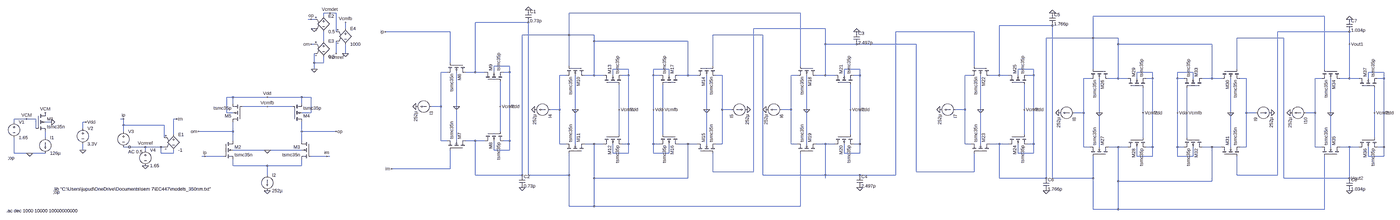
[diagram p0: schematic gm_macro_filter.asc, whole sheet]
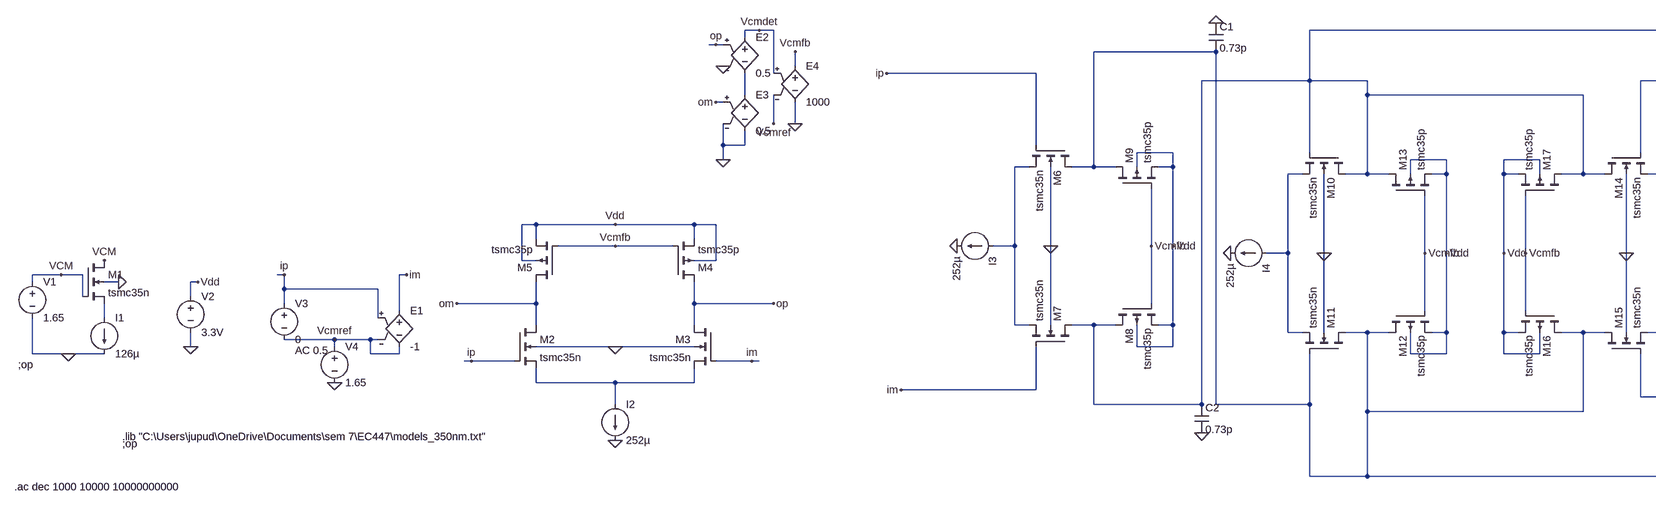
[diagram p1: schematic gm_macro_filter.asc, part, row 1 of 1, column 1 of 2]
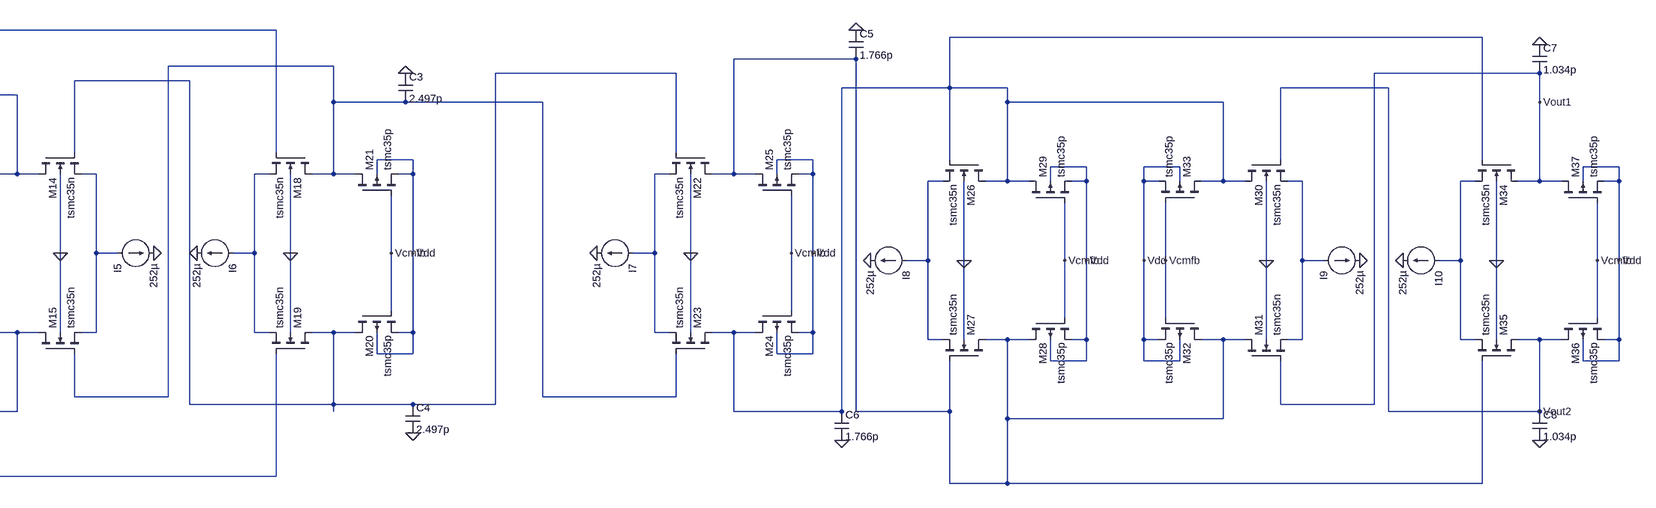
[diagram p2: schematic gm_macro_filter.asc, part, row 1 of 1, column 2 of 2]
gm_macro_filter.asc, the LTspice schematic file:
Version 4
SHEET 1 6368 680
WIRE 576 -576 544 -576
WIRE 608 -576 576 -576
WIRE 3184 -576 2000 -576
WIRE 544 -560 544 -576
WIRE 5984 -560 4800 -560
WIRE 480 -544 464 -544
WIRE 496 -544 480 -544
WIRE 1792 -528 1520 -528
WIRE 4592 -512 4320 -512
WIRE 656 -496 656 -528
WIRE 3312 -496 2944 -496
WIRE 608 -480 608 -576
WIRE 1392 -480 1008 -480
WIRE 4192 -480 3728 -480
WIRE 6112 -480 5744 -480
WIRE 2000 -464 2000 -576
WIRE 2000 -464 1760 -464
WIRE 2128 -464 2000 -464
WIRE 2992 -464 2736 -464
WIRE 4800 -448 4800 -560
WIRE 4800 -448 4560 -448
WIRE 4928 -448 4800 -448
WIRE 5776 -448 5536 -448
WIRE 544 -432 544 -480
WIRE 2128 -432 2128 -464
WIRE 2608 -432 2128 -432
WIRE 496 -416 480 -416
WIRE 3312 -416 3312 -496
WIRE 3472 -416 3312 -416
WIRE 3840 -416 3472 -416
WIRE 4928 -416 4928 -448
WIRE 5408 -416 4928 -416
WIRE 6112 -416 6112 -480
WIRE 608 -368 608 -432
WIRE 656 -368 656 -416
WIRE 496 -320 496 -368
WIRE 544 -320 544 -352
WIRE 544 -320 496 -320
WIRE 1392 -320 1392 -480
WIRE 1696 -304 1616 -304
WIRE 2000 -304 2000 -464
WIRE 2736 -304 2736 -464
WIRE 3184 -304 3184 -576
WIRE 4192 -304 4192 -480
WIRE 496 -288 496 -320
WIRE 2304 -288 2224 -288
WIRE 2512 -288 2432 -288
WIRE 3488 -288 3408 -288
WIRE 4496 -288 4416 -288
WIRE 4800 -288 4800 -448
WIRE 5536 -288 5536 -448
WIRE 5984 -288 5984 -560
WIRE 1376 -272 1344 -272
WIRE 1520 -272 1520 -528
WIRE 1520 -272 1472 -272
WIRE 1568 -272 1520 -272
WIRE 1616 -272 1616 -304
WIRE 1696 -272 1696 -304
WIRE 1696 -272 1664 -272
WIRE 5104 -272 5024 -272
WIRE 5312 -272 5232 -272
WIRE 6288 -272 6208 -272
WIRE 1984 -256 1952 -256
WIRE 2128 -256 2128 -432
WIRE 2128 -256 2080 -256
WIRE 2176 -256 2128 -256
WIRE 2224 -256 2224 -288
WIRE 2304 -256 2304 -288
WIRE 2304 -256 2272 -256
WIRE 2432 -256 2432 -288
WIRE 2464 -256 2432 -256
WIRE 2512 -256 2512 -288
WIRE 2608 -256 2608 -432
WIRE 2608 -256 2560 -256
WIRE 2656 -256 2608 -256
WIRE 2784 -256 2752 -256
WIRE 3168 -256 3136 -256
WIRE 3312 -256 3312 -416
WIRE 3312 -256 3264 -256
WIRE 3360 -256 3312 -256
WIRE 3408 -256 3408 -288
WIRE 3488 -256 3488 -288
WIRE 3488 -256 3456 -256
WIRE 4176 -256 4144 -256
WIRE 4320 -256 4320 -512
WIRE 4320 -256 4272 -256
WIRE 4368 -256 4320 -256
WIRE 4416 -256 4416 -288
WIRE 4496 -256 4496 -288
WIRE 4496 -256 4464 -256
WIRE 4784 -240 4752 -240
WIRE 4928 -240 4928 -416
WIRE 4928 -240 4880 -240
WIRE 4976 -240 4928 -240
WIRE 5024 -240 5024 -272
WIRE 5104 -240 5104 -272
WIRE 5104 -240 5072 -240
WIRE 5232 -240 5232 -272
WIRE 5264 -240 5232 -240
WIRE 5312 -240 5312 -272
WIRE 5408 -240 5408 -416
WIRE 5408 -240 5360 -240
WIRE 5456 -240 5408 -240
WIRE 5584 -240 5552 -240
WIRE 5968 -240 5936 -240
WIRE 6112 -240 6112 -416
WIRE 6112 -240 6064 -240
WIRE 6160 -240 6112 -240
WIRE 6208 -240 6208 -272
WIRE 6288 -240 6288 -272
WIRE 6288 -240 6256 -240
WIRE 80 -144 48 -144
WIRE 256 -144 80 -144
WIRE 432 -144 256 -144
WIRE 480 -144 432 -144
WIRE 80 -112 80 -144
WIRE 432 -112 432 -144
WIRE 256 -96 128 -96
WIRE 384 -96 256 -96
WIRE 1344 -96 1344 -272
WIRE 1344 -96 1296 -96
WIRE 1424 -96 1424 -272
WIRE 1648 -96 1648 -224
WIRE 1696 -96 1696 -272
WIRE 1952 -80 1952 -256
WIRE 1952 -80 1904 -80
WIRE 2032 -80 2032 -256
WIRE 2256 -80 2256 -208
WIRE 2304 -80 2304 -256
WIRE 2432 -80 2432 -256
WIRE 2480 -80 2480 -208
WIRE 2704 -80 2704 -256
WIRE 2784 -80 2784 -256
WIRE 2832 -80 2784 -80
WIRE 3136 -80 3136 -256
WIRE 3136 -80 3088 -80
WIRE 3216 -80 3216 -256
WIRE 3440 -80 3440 -208
WIRE 3488 -80 3488 -256
WIRE 4144 -80 4144 -256
WIRE 4144 -80 4096 -80
WIRE 4224 -80 4224 -256
WIRE 4448 -80 4448 -208
WIRE 4496 -80 4496 -256
WIRE 48 -64 48 -144
WIRE 80 -64 48 -64
WIRE 480 -64 480 -144
WIRE 480 -64 432 -64
WIRE 4752 -64 4752 -240
WIRE 4752 -64 4704 -64
WIRE 4832 -64 4832 -240
WIRE 5056 -64 5056 -192
WIRE 5104 -64 5104 -240
WIRE 5232 -64 5232 -240
WIRE 5280 -64 5280 -192
WIRE 5504 -64 5504 -240
WIRE 5584 -64 5584 -240
WIRE 5632 -64 5584 -64
WIRE 5936 -64 5936 -240
WIRE 5936 -64 5888 -64
WIRE 6016 -64 6016 -240
WIRE 6240 -64 6240 -192
WIRE 6288 -64 6288 -240
WIRE -976 -32 -1040 -32
WIRE -928 -32 -976 -32
WIRE -480 -32 -496 -32
WIRE -208 -32 -224 -32
WIRE -1040 -16 -1040 -32
WIRE -848 -16 -880 -16
WIRE -672 -16 -688 -16
WIRE -480 0 -480 -32
WIRE -272 0 -480 0
WIRE -928 16 -928 -32
WIRE -688 16 -688 -16
WIRE -480 32 -480 0
WIRE 80 32 80 -16
WIRE 80 32 -96 32
WIRE 432 32 432 -16
WIRE 608 32 432 32
WIRE 1648 32 1648 -96
WIRE -224 48 -224 -32
WIRE 2256 48 2256 -80
WIRE 2480 48 2480 -80
WIRE 3440 48 3440 -80
WIRE 4448 48 4448 -80
WIRE -880 64 -880 32
WIRE -272 64 -272 0
WIRE 5056 64 5056 -64
WIRE 5280 64 5280 -64
WIRE 6240 64 6240 -64
WIRE 80 80 80 32
WIRE 432 80 432 32
WIRE 1344 80 1344 -96
WIRE 1376 80 1344 80
WIRE 1424 80 1424 -96
WIRE 1520 80 1472 80
WIRE 1568 80 1520 80
WIRE 1696 80 1696 -96
WIRE 1696 80 1664 80
WIRE 1952 96 1952 -80
WIRE 1984 96 1952 96
WIRE 2032 96 2032 -80
WIRE 2128 96 2080 96
WIRE 2176 96 2128 96
WIRE 2304 96 2304 -80
WIRE 2304 96 2272 96
WIRE 2432 96 2432 -80
WIRE 2464 96 2432 96
WIRE 2608 96 2560 96
WIRE 2656 96 2608 96
WIRE 2704 96 2704 -80
WIRE 2784 96 2784 -80
WIRE 2784 96 2752 96
WIRE 3136 96 3136 -80
WIRE 3168 96 3136 96
WIRE 3216 96 3216 -80
WIRE 3312 96 3264 96
WIRE 3360 96 3312 96
WIRE 3488 96 3488 -80
WIRE 3488 96 3456 96
WIRE 4144 96 4144 -80
WIRE 4176 96 4144 96
WIRE 4224 96 4224 -80
WIRE 4320 96 4272 96
WIRE 4368 96 4320 96
WIRE 4496 96 4496 -80
WIRE 4496 96 4464 96
WIRE -368 112 -480 112
WIRE -288 112 -368 112
WIRE -272 112 -288 112
WIRE 4752 112 4752 -64
WIRE 4784 112 4752 112
WIRE 4832 112 4832 -64
WIRE 4928 112 4880 112
WIRE 4976 112 4928 112
WIRE 5104 112 5104 -64
WIRE 5104 112 5072 112
WIRE 5232 112 5232 -64
WIRE 5264 112 5232 112
WIRE 5408 112 5360 112
WIRE 5456 112 5408 112
WIRE 5504 112 5504 -64
WIRE 5584 112 5584 -64
WIRE 5584 112 5552 112
WIRE 5936 112 5936 -64
WIRE 5968 112 5936 112
WIRE 6016 112 6016 -64
WIRE 6112 112 6064 112
WIRE 6160 112 6112 112
WIRE 6288 112 6288 -64
WIRE 6288 112 6256 112
WIRE -688 128 -688 96
WIRE -368 128 -368 112
WIRE 256 128 80 128
WIRE 432 128 256 128
WIRE 1616 128 1616 80
WIRE 1696 128 1696 80
WIRE 1696 128 1616 128
WIRE -1040 144 -1040 64
WIRE -960 144 -1040 144
WIRE -880 144 -960 144
WIRE -288 144 -288 112
WIRE -224 144 -224 128
WIRE -224 144 -288 144
WIRE 2224 144 2224 96
WIRE 2304 144 2304 96
WIRE 2304 144 2224 144
WIRE 2432 144 2432 96
WIRE 2512 144 2512 96
WIRE 2512 144 2432 144
WIRE 3408 144 3408 96
WIRE 3488 144 3488 96
WIRE 3488 144 3408 144
WIRE 4416 144 4416 96
WIRE 4496 144 4496 96
WIRE 4496 144 4416 144
WIRE -64 160 -80 160
WIRE 32 160 -64 160
WIRE 560 160 480 160
WIRE 576 160 560 160
WIRE 5024 160 5024 112
WIRE 5104 160 5104 112
WIRE 5104 160 5024 160
WIRE 5232 160 5232 112
WIRE 5312 160 5312 112
WIRE 5312 160 5232 160
WIRE 6208 160 6208 112
WIRE 6288 160 6288 112
WIRE 6288 160 6208 160
WIRE 80 208 80 176
WIRE 256 208 80 208
WIRE 432 208 432 176
WIRE 432 208 256 208
WIRE 1392 224 1392 128
WIRE 1392 224 1040 224
WIRE 2736 240 2736 144
WIRE 2944 240 2944 -496
WIRE 2944 240 2736 240
WIRE 3840 240 3840 -416
WIRE 4192 240 4192 144
WIRE 4192 240 3840 240
WIRE 256 256 256 208
WIRE 1520 256 1520 80
WIRE 1760 256 1760 -464
WIRE 1760 256 1520 256
WIRE 1792 256 1792 -528
WIRE 2000 256 2000 144
WIRE 2000 256 1792 256
WIRE 2992 256 2992 -464
WIRE 3312 256 3312 96
WIRE 3312 256 2992 256
WIRE 3488 256 3312 256
WIRE 3728 256 3728 -480
WIRE 3728 256 3488 256
WIRE 5536 256 5536 160
WIRE 5744 256 5744 -480
WIRE 5744 256 5536 256
WIRE 2128 272 2128 96
WIRE 2608 272 2608 96
WIRE 2608 272 2128 272
WIRE 3312 272 3312 256
WIRE 4320 272 4320 96
WIRE 4560 272 4560 -448
WIRE 4560 272 4320 272
WIRE 4592 272 4592 -512
WIRE 4800 272 4800 160
WIRE 4800 272 4592 272
WIRE 5776 272 5776 -448
WIRE 6112 272 6112 112
WIRE 6112 272 5776 272
WIRE 4928 288 4928 112
WIRE 5408 288 5408 112
WIRE 5408 288 4928 288
WIRE 6112 288 6112 272
WIRE 2000 416 2000 256
WIRE 2128 416 2128 272
WIRE 2128 416 2000 416
WIRE 3184 416 3184 144
WIRE 3184 416 2128 416
WIRE 4800 432 4800 272
WIRE 4928 432 4928 288
WIRE 4928 432 4800 432
WIRE 5984 432 5984 160
WIRE 5984 432 4928 432
FLAG -960 144 0
FLAG -848 -16 0
FLAG -976 -32 VCM
FLAG -880 -64 VCM
FLAG -672 -16 Vdd
FLAG -688 128 0
FLAG -368 208 0
FLAG -480 -32 ip
FLAG -208 -32 im
FLAG -368 112 Vcmref
FLAG 496 -496 0
FLAG 656 -368 0
FLAG 496 -288 0
FLAG 480 -544 op
FLAG 480 -416 om
FLAG 576 -576 Vcmdet
FLAG 608 -368 Vcmref
FLAG 656 -528 Vcmfb
FLAG 256 128 0
FLAG 256 336 0
FLAG 608 32 op
FLAG 560 160 im
FLAG -96 32 om
FLAG -64 160 ip
FLAG 256 -144 Vdd
FLAG 256 -96 Vcmfb
FLAG 1424 -96 0
FLAG 1216 -96 0
FLAG 1040 224 im
FLAG 1008 -480 ip
FLAG 1696 -96 Vdd
FLAG 1648 -96 Vcmfb
FLAG 2032 -80 0
FLAG 1824 -80 0
FLAG 2304 -80 Vdd
FLAG 2256 -80 Vcmfb
FLAG 2704 -80 0
FLAG 2912 -80 0
FLAG 2432 -80 Vdd
FLAG 2480 -80 Vcmfb
FLAG 3216 -80 0
FLAG 3008 -80 0
FLAG 3488 -80 Vdd
FLAG 3440 -80 Vcmfb
FLAG 4224 -80 0
FLAG 4016 -80 0
FLAG 4496 -80 Vdd
FLAG 4448 -80 Vcmfb
FLAG 4832 -64 0
FLAG 4624 -64 0
FLAG 5104 -64 Vdd
FLAG 5056 -64 Vcmfb
FLAG 5504 -64 0
FLAG 5712 -64 0
FLAG 5232 -64 Vdd
FLAG 5280 -64 Vcmfb
FLAG 6016 -64 0
FLAG 5808 -64 0
FLAG 6288 -64 Vdd
FLAG 6240 -64 Vcmfb
FLAG 1792 -592 0
FLAG 1760 320 0
FLAG 3472 -480 0
FLAG 3488 320 0
FLAG 4592 -576 0
FLAG 4560 336 0
FLAG 6112 -544 0
FLAG 6112 336 0
FLAG 6112 -416 Vout1
FLAG 6112 272 Vout2
DATAFLAG 0 32 ""
DATAFLAG 512 32 ""
DATAFLAG 512 160 ""
DATAFLAG 0 160 ""
DATAFLAG 1520 -352 ""
DATAFLAG 1520 160 ""
DATAFLAG 1392 160 ""
DATAFLAG 1392 -352 ""
DATAFLAG 2128 -336 ""
DATAFLAG 2128 176 ""
DATAFLAG 2000 176 ""
DATAFLAG 2000 -336 ""
DATAFLAG 2608 -336 ""
DATAFLAG 2608 176 ""
DATAFLAG 2736 176 ""
DATAFLAG 2736 -336 ""
DATAFLAG 3312 -336 ""
DATAFLAG 3312 176 ""
DATAFLAG 3184 176 ""
DATAFLAG 3184 -336 ""
DATAFLAG 4320 -336 ""
DATAFLAG 4320 176 ""
DATAFLAG 4192 176 ""
DATAFLAG 4192 -336 ""
DATAFLAG 4928 -320 ""
DATAFLAG 4928 192 ""
DATAFLAG 4800 192 ""
DATAFLAG 4800 -320 ""
DATAFLAG 5408 -320 ""
DATAFLAG 5408 192 ""
DATAFLAG 5536 192 ""
DATAFLAG 5536 -320 ""
DATAFLAG 6112 -320 ""
DATAFLAG 6112 192 ""
DATAFLAG 5984 192 ""
DATAFLAG 5984 -320 ""
SYMBOL voltage -1040 -32 R0
SYMATTR InstName V1
SYMATTR Value 1.65
SYMBOL current -880 64 R0
WINDOW 123 0 0 Left 0
WINDOW 39 0 0 Left 0
SYMATTR InstName I1
SYMATTR Value 126µ
SYMBOL nmos4 -928 -64 R0
SYMATTR InstName M1
SYMATTR Value tsmc35n
SYMATTR Value2 l=0.5u w=1.8u m=8
SYMBOL voltage -688 0 R0
SYMATTR InstName V2
SYMATTR Value 3.3V
SYMBOL voltage -480 16 R0
WINDOW 123 24 120 Left 2
WINDOW 39 0 0 Left 0
SYMATTR Value2 AC 0.5
SYMATTR InstName V3
SYMATTR Value 0
SYMBOL voltage -368 112 R0
WINDOW 123 0 0 Left 0
WINDOW 39 0 0 Left 0
SYMATTR InstName V4
SYMATTR Value 1.65
SYMBOL e -224 32 R0
SYMATTR InstName E1
SYMATTR Value -1
SYMBOL e 544 -576 R0
SYMATTR InstName E2
SYMATTR Value 0.5
SYMBOL e 544 -448 R0
SYMATTR InstName E3
SYMATTR Value 0.5
SYMBOL e 656 -512 R0
SYMATTR InstName E4
SYMATTR Value 1000
SYMBOL nmos4 32 80 R0
SYMATTR InstName M2
SYMATTR Value tsmc35n
SYMATTR Value2 l=0.5u w=1.8u m=8
SYMBOL nmos4 480 80 M0
SYMATTR InstName M3
SYMATTR Value tsmc35n
SYMATTR Value2 l=0.5u w=1.8u m=8
SYMBOL pmos4 384 -16 M180
SYMATTR InstName M4
SYMATTR Value tsmc35p
SYMATTR Value2 l=0.5u w=1.8u m=20
SYMBOL pmos4 128 -16 R180
SYMATTR InstName M5
SYMATTR Value tsmc35p
SYMATTR Value2 l=0.5u w=1.8u m=20
SYMBOL current 256 256 R0
WINDOW 123 0 0 Left 0
WINDOW 39 0 0 Left 0
SYMATTR InstName I2
SYMATTR Value 252µ
SYMBOL nmos4 1472 -320 R90
SYMATTR InstName M6
SYMATTR Value tsmc35n
SYMATTR Value2 l=0.5u w=1.8u m=8
SYMBOL nmos4 1472 128 M270
SYMATTR InstName M7
SYMATTR Value tsmc35n
SYMATTR Value2 l=0.5u w=1.8u m=8
SYMBOL pmos4 1568 32 M90
SYMATTR InstName M8
SYMATTR Value tsmc35p
SYMATTR Value2 l=0.5u w=1.8u m=20
SYMBOL pmos4 1568 -224 R270
SYMATTR InstName M9
SYMATTR Value tsmc35p
SYMATTR Value2 l=0.5u w=1.8u m=20
SYMBOL current 1296 -96 R90
WINDOW 123 0 0 Left 0
WINDOW 39 0 0 Left 0
SYMATTR InstName I3
SYMATTR Value 252µ
SYMBOL nmos4 2080 -304 R90
SYMATTR InstName M10
SYMATTR Value tsmc35n
SYMATTR Value2 l=0.5u w=1.8u m=8
SYMBOL nmos4 2080 144 M270
SYMATTR InstName M11
SYMATTR Value tsmc35n
SYMATTR Value2 l=0.5u w=1.8u m=8
SYMBOL pmos4 2176 48 M90
SYMATTR InstName M12
SYMATTR Value tsmc35p
SYMATTR Value2 l=0.5u w=1.8u m=20
SYMBOL pmos4 2176 -208 R270
SYMATTR InstName M13
SYMATTR Value tsmc35p
SYMATTR Value2 l=0.5u w=1.8u m=20
SYMBOL current 1904 -80 R90
WINDOW 123 0 0 Left 0
WINDOW 39 0 0 Left 0
SYMATTR InstName I4
SYMATTR Value 252µ
SYMBOL nmos4 2656 -304 M90
SYMATTR InstName M14
SYMATTR Value tsmc35n
SYMATTR Value2 l=0.5u w=1.8u m=8
SYMBOL nmos4 2656 144 R270
SYMATTR InstName M15
SYMATTR Value tsmc35n
SYMATTR Value2 l=0.5u w=1.8u m=8
SYMBOL pmos4 2560 48 R90
SYMATTR InstName M16
SYMATTR Value tsmc35p
SYMATTR Value2 l=0.5u w=1.8u m=20
SYMBOL pmos4 2560 -208 M270
SYMATTR InstName M17
SYMATTR Value tsmc35p
SYMATTR Value2 l=0.5u w=1.8u m=20
SYMBOL current 2832 -80 M90
WINDOW 123 0 0 Left 0
WINDOW 39 0 0 Left 0
SYMATTR InstName I5
SYMATTR Value 252µ
SYMBOL nmos4 3264 -304 R90
SYMATTR InstName M18
SYMATTR Value tsmc35n
SYMATTR Value2 l=0.5u w=1.8u m=8
SYMBOL nmos4 3264 144 M270
SYMATTR InstName M19
SYMATTR Value tsmc35n
SYMATTR Value2 l=0.5u w=1.8u m=8
SYMBOL pmos4 3360 48 M90
SYMATTR InstName M20
SYMATTR Value tsmc35p
SYMATTR Value2 l=0.5u w=1.8u m=20
SYMBOL pmos4 3360 -208 R270
SYMATTR InstName M21
SYMATTR Value tsmc35p
SYMATTR Value2 l=0.5u w=1.8u m=20
SYMBOL current 3088 -80 R90
WINDOW 123 0 0 Left 0
WINDOW 39 0 0 Left 0
SYMATTR InstName I6
SYMATTR Value 252µ
SYMBOL nmos4 4272 -304 R90
SYMATTR InstName M22
SYMATTR Value tsmc35n
SYMATTR Value2 l=0.5u w=1.8u m=8
SYMBOL nmos4 4272 144 M270
SYMATTR InstName M23
SYMATTR Value tsmc35n
SYMATTR Value2 l=0.5u w=1.8u m=8
SYMBOL pmos4 4368 48 M90
SYMATTR InstName M24
SYMATTR Value tsmc35p
SYMATTR Value2 l=0.5u w=1.8u m=20
SYMBOL pmos4 4368 -208 R270
SYMATTR InstName M25
SYMATTR Value tsmc35p
SYMATTR Value2 l=0.5u w=1.8u m=20
SYMBOL current 4096 -80 R90
WINDOW 123 0 0 Left 0
WINDOW 39 0 0 Left 0
SYMATTR InstName I7
SYMATTR Value 252µ
SYMBOL nmos4 4880 -288 R90
SYMATTR InstName M26
SYMATTR Value tsmc35n
SYMATTR Value2 l=0.5u w=1.8u m=8
SYMBOL nmos4 4880 160 M270
SYMATTR InstName M27
SYMATTR Value tsmc35n
SYMATTR Value2 l=0.5u w=1.8u m=8
SYMBOL pmos4 4976 64 M90
SYMATTR InstName M28
SYMATTR Value tsmc35p
SYMATTR Value2 l=0.5u w=1.8u m=20
SYMBOL pmos4 4976 -192 R270
SYMATTR InstName M29
SYMATTR Value tsmc35p
SYMATTR Value2 l=0.5u w=1.8u m=20
SYMBOL current 4704 -64 R90
WINDOW 123 0 0 Left 0
WINDOW 39 0 0 Left 0
SYMATTR InstName I8
SYMATTR Value 252µ
SYMBOL nmos4 5456 -288 M90
SYMATTR InstName M30
SYMATTR Value tsmc35n
SYMATTR Value2 l=0.5u w=1.8u m=8
SYMBOL nmos4 5456 160 R270
SYMATTR InstName M31
SYMATTR Value tsmc35n
SYMATTR Value2 l=0.5u w=1.8u m=8
SYMBOL pmos4 5360 64 R90
SYMATTR InstName M32
SYMATTR Value tsmc35p
SYMATTR Value2 l=0.5u w=1.8u m=20
SYMBOL pmos4 5360 -192 M270
SYMATTR InstName M33
SYMATTR Value tsmc35p
SYMATTR Value2 l=0.5u w=1.8u m=20
SYMBOL current 5632 -64 M90
WINDOW 123 0 0 Left 0
WINDOW 39 0 0 Left 0
SYMATTR InstName I9
SYMATTR Value 252µ
SYMBOL nmos4 6064 -288 R90
SYMATTR InstName M34
SYMATTR Value tsmc35n
SYMATTR Value2 l=0.5u w=1.8u m=8
SYMBOL nmos4 6064 160 M270
SYMATTR InstName M35
SYMATTR Value tsmc35n
SYMATTR Value2 l=0.5u w=1.8u m=8
SYMBOL pmos4 6160 64 M90
SYMATTR InstName M36
SYMATTR Value tsmc35p
SYMATTR Value2 l=0.5u w=1.8u m=20
SYMBOL pmos4 6160 -192 R270
SYMATTR InstName M37
SYMATTR Value tsmc35p
SYMATTR Value2 l=0.5u w=1.8u m=20
SYMBOL current 5888 -64 R90
WINDOW 123 0 0 Left 0
WINDOW 39 0 0 Left 0
SYMATTR InstName I10
SYMATTR Value 252µ
SYMBOL cap 1776 -592 R0
SYMATTR InstName C1
SYMATTR Value 0.73p
SYMBOL cap 1744 256 R0
SYMATTR InstName C2
SYMATTR Value 0.73p
SYMBOL cap 3456 -480 R0
SYMATTR InstName C3
SYMATTR Value 2.497p
SYMBOL cap 3472 256 R0
SYMATTR InstName C4
SYMATTR Value 2.497p
SYMBOL cap 4576 -576 R0
SYMATTR InstName C5
SYMATTR Value 1.766p
SYMBOL cap 4544 272 R0
SYMATTR InstName C6
SYMATTR Value 1.766p
SYMBOL cap 6096 -544 R0
SYMATTR InstName C7
SYMATTR Value 1.034p
SYMBOL cap 6096 272 R0
SYMATTR InstName C8
SYMATTR Value 1.034p
TEXT -1072 168 Left 2 !;op
TEXT -840 328 Left 2 !.lib "C:\\Users\\jupud\\OneDrive\\Documents\\sem 7\\EC447\\models_350nm.txt"
TEXT -840 344 Left 2 !;op
TEXT -1080 440 Left 2 !.ac dec 1000 10000 10000000000

The netlist it stands for:
* gm_macro_filter.asc
V1 VCM 0 1.65
I1 N016 0 126µ
M1 VCM VCM N016 0 tsmc35n l=0.5u w=1.8u m=8
V2 Vdd 0 3.3V
V3 ip Vcmref 0 AC 0.5
V4 Vcmref 0 1.65
E1 im Vcmref ip Vcmref -1
E2 Vcmdet N007 op 0 0.5
E3 N007 0 om 0 0.5
E4 Vcmfb 0 Vcmdet Vcmref 1000
M2 om ip N017 0 tsmc35n l=0.5u w=1.8u m=8
M3 op im N017 0 tsmc35n l=0.5u w=1.8u m=8
M4 op Vcmfb Vdd Vdd tsmc35p l=0.5u w=1.8u m=20
M5 om Vcmfb Vdd Vdd tsmc35p l=0.5u w=1.8u m=20
I2 N017 0 252µ
M6 N003 ip N008 0 tsmc35n l=0.5u w=1.8u m=8
M7 N001 im N008 0 tsmc35n l=0.5u w=1.8u m=8
M8 N001 Vcmfb Vdd Vdd tsmc35p l=0.5u w=1.8u m=20
M9 N003 Vcmfb Vdd Vdd tsmc35p l=0.5u w=1.8u m=20
I3 N008 0 252µ
M10 N001 N001 N009 0 tsmc35n l=0.5u w=1.8u m=8
M11 N003 N003 N009 0 tsmc35n l=0.5u w=1.8u m=8
M12 N003 Vcmfb Vdd Vdd tsmc35p l=0.5u w=1.8u m=20
M13 N001 Vcmfb Vdd Vdd tsmc35p l=0.5u w=1.8u m=20
I4 N009 0 252µ
M14 N001 N006 N010 0 tsmc35n l=0.5u w=1.8u m=8
M15 N003 N005 N010 0 tsmc35n l=0.5u w=1.8u m=8
M16 N003 Vcmfb Vdd Vdd tsmc35p l=0.5u w=1.8u m=20
M17 N001 Vcmfb Vdd Vdd tsmc35p l=0.5u w=1.8u m=20
I5 N010 0 252µ
M18 N005 N001 N011 0 tsmc35n l=0.5u w=1.8u m=8
M19 N006 N003 N011 0 tsmc35n l=0.5u w=1.8u m=8
M20 N006 Vcmfb Vdd Vdd tsmc35p l=0.5u w=1.8u m=20
M21 N005 Vcmfb Vdd Vdd tsmc35p l=0.5u w=1.8u m=20
I6 N011 0 252µ
M22 N004 N006 N012 0 tsmc35n l=0.5u w=1.8u m=8
M23 N002 N005 N012 0 tsmc35n l=0.5u w=1.8u m=8
M24 N002 Vcmfb Vdd Vdd tsmc35p l=0.5u w=1.8u m=20
M25 N004 Vcmfb Vdd Vdd tsmc35p l=0.5u w=1.8u m=20
I7 N012 0 252µ
M26 N002 N002 N013 0 tsmc35n l=0.5u w=1.8u m=8
M27 N004 N004 N013 0 tsmc35n l=0.5u w=1.8u m=8
M28 N004 Vcmfb Vdd Vdd tsmc35p l=0.5u w=1.8u m=20
M29 N002 Vcmfb Vdd Vdd tsmc35p l=0.5u w=1.8u m=20
I8 N013 0 252µ
M30 N002 Vout2 N014 0 tsmc35n l=0.5u w=1.8u m=8
M31 N004 Vout1 N014 0 tsmc35n l=0.5u w=1.8u m=8
M32 N004 Vcmfb Vdd Vdd tsmc35p l=0.5u w=1.8u m=20
M33 N002 Vcmfb Vdd Vdd tsmc35p l=0.5u w=1.8u m=20
I9 N014 0 252µ
M34 Vout1 N002 N015 0 tsmc35n l=0.5u w=1.8u m=8
M35 Vout2 N004 N015 0 tsmc35n l=0.5u w=1.8u m=8
M36 Vout2 Vcmfb Vdd Vdd tsmc35p l=0.5u w=1.8u m=20
M37 Vout1 Vcmfb Vdd Vdd tsmc35p l=0.5u w=1.8u m=20
I10 N015 0 252µ
C1 0 N003 0.73p
C2 N001 0 0.73p
C3 0 N005 2.497p
C4 N006 0 2.497p
C5 0 N004 1.766p
C6 N002 0 1.766p
C7 0 Vout1 1.034p
C8 Vout2 0 1.034p
.model NMOS NMOS
.model PMOS PMOS
.lib standard.mos
;op
.lib "C:\Users\jupud\OneDrive\Documents\sem 7\EC447\models_350nm.txt"
;op
.ac dec 1000 10000 10000000000
.backanno
.end